# Altium schematic sheet MicrobitBoardSensor.SchDoc
size A
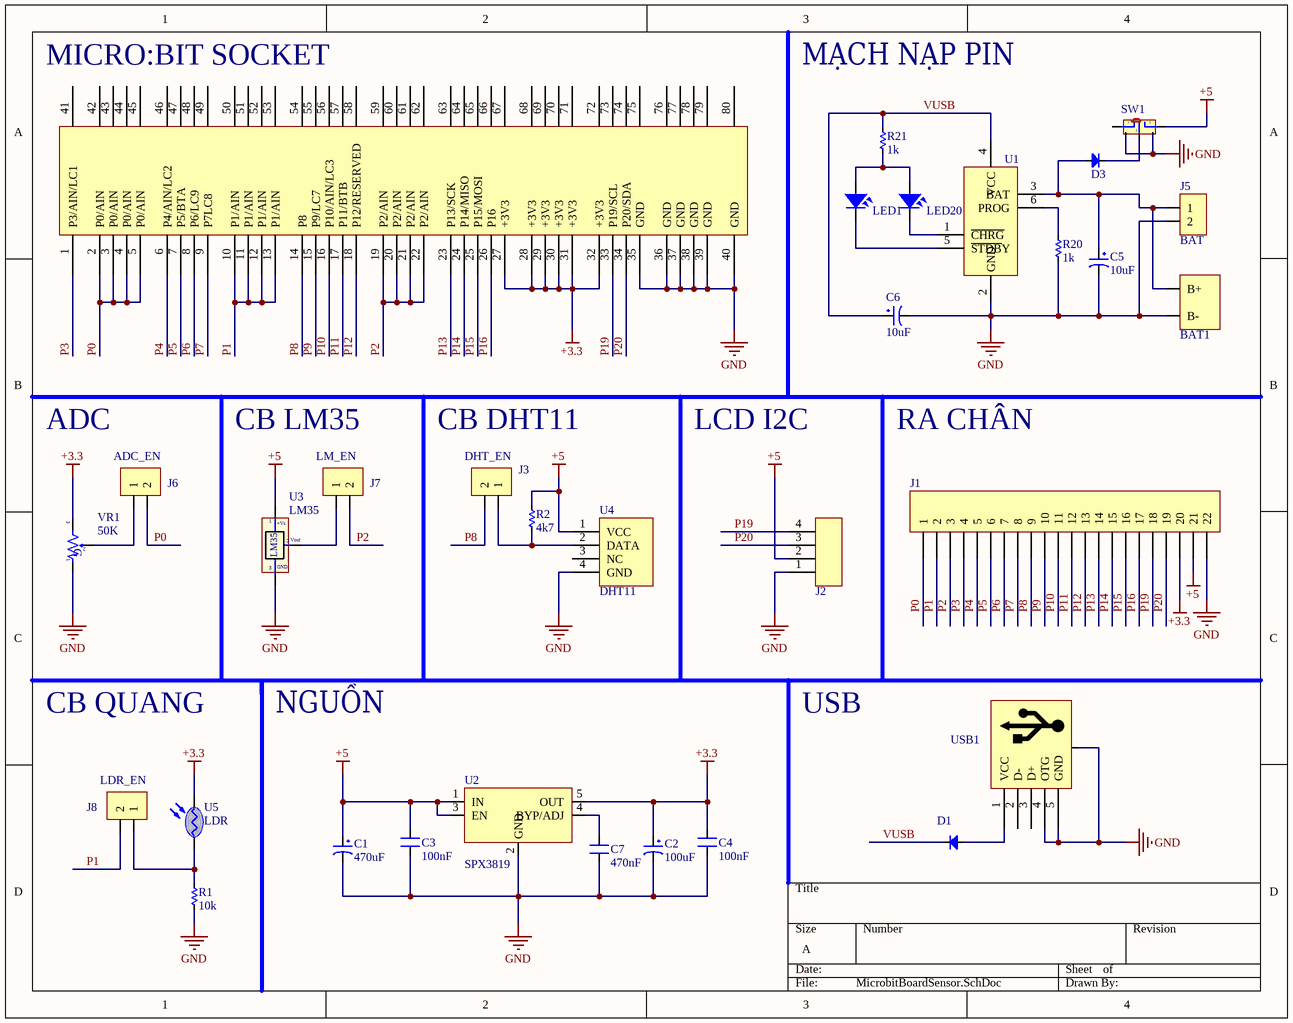
[diagram p0: MicrobitBoardSensor.SchDoc]

## Parts
BAT1  BATERRY SOCKET  [BAT_SOCKET]  (value not drawn)
BBC1  BBC_SOCKET  [BBC_SK_DIP]  (value not drawn)
C1  470uF  [tu tantalum smd7343]
C2  100uF  [tu tantalum smd3528]
C3  100nF  [CN-SMD-0805]
C4  100nF  [CN-SMD-0805]
C5  10uF  [tu tantalum smd3528]
C6  10uF  [tu tantalum smd3528]
C7  470nF  [CN-SMD-0805]
D1  SS34  [DIO-SMD-123]  (value not drawn)
D3  SS34  [DIO-SMD-123]  (value not drawn)
J1  JP22  [JP22-D1T]  (value not drawn)
J2  LCD IIC  [XH2.54-4P]  (value not drawn)
J3  DHT_EN  [JP2-CLOSED]
J5  BAT  [JP2-D1T]
J6  ADC_EN  [JP2-CLOSED]
J7  LM_EN  [JP2-CLOSED]
J8  LDR_EN  [JP2-CLOSED]
LED1  F  [LED-0805-Blue]  (value not drawn)
LED20  C  [LED-0805-Blue]  (value not drawn)
R1  10k  [RES-SMD-0805]
R2  4k7  [RES-SMD-0805]
R20  1k  [RES-SMD-0805]
R21  1k  [RES-SMD-0805]
SW1  SW102A  [SW102]  (value not drawn)
U1  TP4057  [SOT23-6]  (value not drawn)
U2  SPX3819  [SOT23-5]
U3  LM35  [TO92-123]
U4  DHT11  [DHT11]
U5  LDR  [CDS]
USB1  PWR  [MicroUSB]  (value not drawn)
VR1  50K  [VR-S3]

## Nets
+3.3: BBC1.27(+3V3) BBC1.28(+3V3) BBC1.29(+3V3) BBC1.30(+3V3) BBC1.31(+3V3) BBC1.32(+3V3) C2.1 C4.1 J1.20 U2.5(OUT) U5.2(K) VR1.3
+5: C1.1 C3.1 J1.21 J2.2 R2.1 SW1.3 U2.1(IN) U2.3(EN) U3.1(+Vs) U4.1(VCC)
GND: BAT1.2(B-) BBC1.35(GND) BBC1.36(GND) BBC1.37(GND) BBC1.38(GND) BBC1.39(GND) BBC1.40(GND) C1.2 C2.2 C3.2 C4.2 C5.2 C6.2 C7.2 J1.22 J2.1 J5.2 R1.2 R20.1 SW1.4 SW1.5 U1.2(GND) U2.2(GND) U3.3(-) U4.4(GND) USB1.0(GND) USB1.4(OTG) USB1.5(GND) VR1.1
P0: BBC1.2(P0/AIN) BBC1.3(P0/AIN) BBC1.4(P0/AIN) BBC1.5(P0/AIN) J1.1 J6.2
P1: BBC1.10(P1/AIN) BBC1.11(P1/AIN) BBC1.12(P1/AIN) BBC1.13(P1/AIN) J1.2 J8.2
P2: BBC1.19(P2/AIN) BBC1.20(P2/AIN) BBC1.21(P2/AIN) BBC1.22(P2/AIN) J1.3 J7.2
P3: BBC1.1(P3/AIN/LC1) J1.4
P4: BBC1.6(P4/AIN/LC2) J1.5
P5: BBC1.7(P5/BTA) J1.6
P6: BBC1.8(P6/LC9) J1.7
P7: BBC1.9(P7LC8) J1.8
P8: BBC1.14(P8) J1.9 J3.2
P9: BBC1.15(P9/LC7) J1.10
P10: BBC1.16(P10/AIN/LC3) J1.11
P11: BBC1.17(P11/BTB) J1.12
P12: BBC1.18(P12/RESERVED) J1.13
P13: BBC1.23(P13/SCK) J1.14
P14: BBC1.24(P14/MISO) J1.15
P15: BBC1.25(P15/MOSI) J1.16
P16: BBC1.26(P16) J1.17
P19: BBC1.33(P19/SCL) J1.18 J2.4
P20: BBC1.34(P20/SDA) J1.19 J2.3
VUSB: C6.1 D1.2(K) R21.2 U1.4(VCC)
NetBAT1_1: BAT1.1(B+) C5.1 D3.1(A) J5.1 U1.3(BAT)
NetC7_1: C7.1 U2.4(BYP/ADJ)
NetD1_1: D1.1(A) USB1.1(VCC)
NetD3_2: D3.2(K) SW1.2
NetJ3_1: J3.1 R2.2 U4.2(DATA)
NetJ6_1: J6.1 VR1.2
NetJ7_1: J7.1 U3.2(Vout)
NetJ8_1: J8.1 R1.1 U5.1(A)
NetLED1_1: LED1.1 LED20.1 R21.1
NetLED1_2: LED1.2 U1.5(~{STDB}Y)
NetLED20_2: LED20.2 U1.1(~{CHRG})
NetR20_2: R20.2 U1.6(PROG)

Not connected (* = marked no-connect by the designer): BBC1 41(P3) 42(P0) 43(P0) 44(P0) 45(P0) 46(P4) 47(P5) 48(P6) 49(P7) 50(P1) 51(P1) 52(P1) 53(P1) 54(P8) 55(P9) 56(P10) 57(P11) 58(P12) 59(P2) 60(P2) 61(P2) 62(P2) 63(P13) 64(P14) 65(P15) 66(P16) 67(+3V3) 68(+3V3) 69(+3V3) 70(+3V3) 71(+3V3) 72(+3V3) 73(P19) 74(P20) 75(GND) 76(GND) 77(GND) 78(GND) 79(GND) 80(GND); SW1 1; U4 3(NC); USB1 2(D-) 3(D+)

## Notes on the sheet
- MICRO:BIT SOCKET
- MẠCH NẠP PIN
- ADC
- CB LM35
- CB DHT11
- LCD I2C
- RA CHÂN
- CB QUANG
- NGUỒN
- USB
- (in symbol LM35) GND
- (in symbol VR-S) G

## Library data of the parts
BAT1 = BAT_SOCKET
C1 = Tu tantalum 470uF 10V SMD7343: Dán; Don_Vi: Con; So_Chan: 2; Ten_Linh_Kien: Tụ tantalum 477A-470uF 10V SMD7343; Ma_Hang: MH001956; Chung_Loai: Dán; Kieu_Chan: *
C2 = Tu tantalum 100uF 6.3V SMD3528: Dán; Don_Vi: Con; So_Chan: 2; Ten_Linh_Kien: Tụ tantalum 107J-100uF 6.3V SMD3528; Ma_Hang: MH007595; Chung_Loai: Dán; Kieu_Chan: *
C3 C4 C7 = CN: Value: 33pF
C5 C6 = Tu tantalum 10uF 16V SMD3528: Dán; Don_Vi: Con; So_Chan: 2; Ten_Linh_Kien: Tụ tantalum 106C-10uF 16V SMD3528; Ma_Hang: MH007474; Chung_Loai: Dán; Kieu_Chan: *
D1 D3 = Diode SMD: Default Diode; Code - JEDEC: DO-214-AB; Value: 1N5007; Published: 8-Jun-2000; Revision: July-2002: Re-released for DXP Platform.; Publisher: Altium Limited
J1 = JP22: WR-PHD 2.54 mm Angled Socket Header; Manufacturer: W¨¹rth Elektronik eiSos GmbH; partNo: 613022143121; ComponentLink1 Description: Manufacturer; ComponentLink2 Description: Datasheet; NoPins: 22; Created Date: 29 March 2013; ComponentLink1URL: http://www.we-online.com; ComponentLink2URL: http://katalog.we-online.de/em/datasheet/6130xx143121.pdf; Created by: Karrer Zheng
J2 = XH2.54-4P
J3 J5-J8 = JP2: WR-PHD 2.54 mm Angled Socket Header; Manufacturer: W¨¹rth Elektronik eiSos GmbH; partNo: 613002143121; ComponentLink1 Description: Manufacturer; ComponentLink2 Description: Datasheet; NoPins: 02; Created Date: 29 March 2013; ComponentLink1URL: http://www.we-online.com; ComponentLink2URL: http://katalog.we-online.de/em/datasheet/6130xx143121.pdf; Created by: Karrer Zheng
LED1 LED20 = LED SMD: Value: LED 3 - 5 ly 2 Colour
R1 R2 R20 R21 = Res-SMD: Resistor; Manufacturer: Generic Components; Class: Passive; Published: 08/06/2000; Publisher: Altium Hobart Technology Centre
SW1 = SW102A: Switch 102 on Broad; Value: Switch 102 On Board
U3 = LM35: Teminal; Value: LM35
U5 = LDR: Quang Tro
USB1 = MicroUSB
VR1 = VR-S: Var Resistor; Value: Volume 50k
BBC1 = BBC_SOCKET: DeviceName: BBC_SOCKET; LibraryName: microbit; DeviceSetName: BBC_SOCKET; Package: BBC_SOCKET